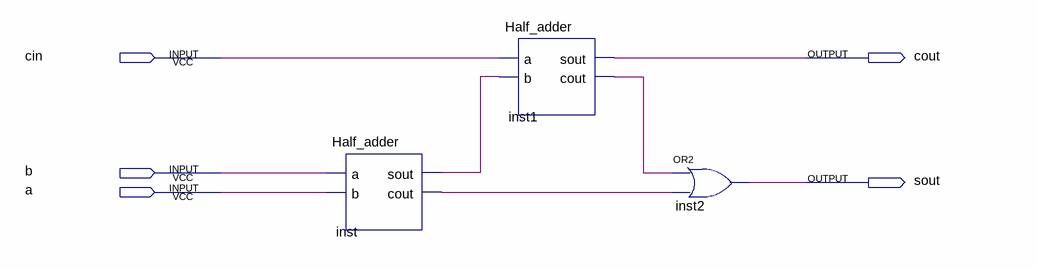
[diagram p0: schematic sheet]
// Quartus schematic Full_adder1.bdf as structural Verilog: 3 symbols, 5 pins
module Full_adder1 (
  input  cin,
  input  b,
  input  a,
  output cout,
  output sout
);

  wire inst1_cout, inst_cout, inst_sout;

  Half_adder inst (.a(b), .b(a), .sout(inst_sout), .cout(inst_cout));
  Half_adder inst1 (.a(cin), .b(inst_sout), .sout(cout), .cout(inst1_cout));
  or inst2 (sout, inst1_cout, inst_cout);
endmodule
